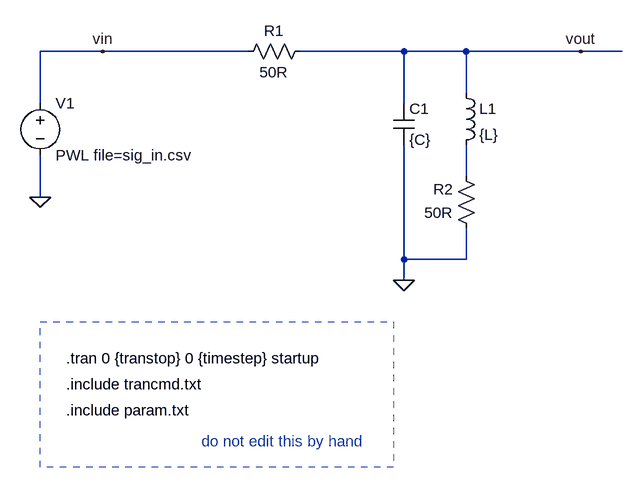
[diagram p0: schematic filter_circuit.asc]
filter_circuit.asc, the LTspice schematic file:
Version 4
SHEET 1 1108 740
WIRE 304 96 208 96
WIRE 528 96 304 96
WIRE 768 96 608 96
WIRE 864 96 768 96
WIRE 1040 96 864 96
WIRE 1104 96 1040 96
WIRE 864 160 864 96
WIRE 208 176 208 96
WIRE 768 176 768 96
WIRE 864 288 864 240
WIRE 208 320 208 256
WIRE 768 416 768 240
WIRE 864 416 864 368
WIRE 864 416 768 416
WIRE 768 448 768 416
FLAG 304 96 vin
FLAG 208 320 0
FLAG 1040 96 vout
FLAG 768 448 0
SYMBOL voltage 208 160 R0
WINDOW 39 0 0 Left 0
SYMATTR InstName V1
SYMATTR Value PWL file=sig_in.csv
SYMBOL res 624 80 R90
WINDOW 0 0 56 VBottom 2
WINDOW 3 32 56 VTop 2
SYMATTR InstName R1
SYMATTR Value 50R
SYMBOL cap 752 176 R0
SYMATTR InstName C1
SYMATTR Value {C}
SYMBOL ind 848 144 R0
SYMATTR InstName L1
SYMATTR Value {L}
SYMBOL res 880 384 R180
WINDOW 0 36 76 Left 2
WINDOW 3 36 40 Left 2
SYMATTR InstName R2
SYMATTR Value 50R
TEXT 248 568 Left 2 !.tran 0 {transtop} 0 {timestep} startup
TEXT 248 648 Left 2 !.include param.txt
TEXT 248 608 Left 2 !.include trancmd.txt
TEXT 456 696 Left 2 ;do not edit this by hand
RECTANGLE Normal 752 736 208 512 2

The netlist it stands for:
* filter_circuit.asc
V1 vin 0 PWL file=sig_in.csv
R1 vout vin 50R
C1 vout 0 {C}
L1 vout N001 {L}
R2 0 N001 50R
.tran 0 {transtop} 0 {timestep} startup
.include param.txt
.include trancmd.txt
* do not edit this by hand
.backanno
.end